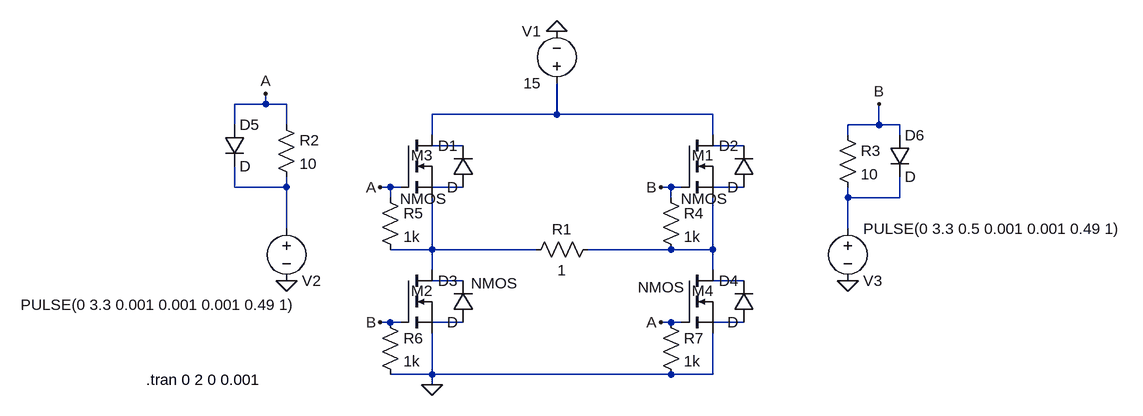
[diagram p0: schematic driver.asc]
driver.asc, the LTspice schematic file:
Version 4
SHEET 1 1168 680
WIRE -176 32 -176 16
WIRE -176 32 -224 32
WIRE -144 32 -176 32
WIRE 272 48 272 0
WIRE 272 48 80 48
WIRE 512 48 272 48
WIRE -224 64 -224 32
WIRE -144 64 -144 32
WIRE 768 64 768 32
WIRE 768 64 720 64
WIRE 800 64 768 64
WIRE 80 80 80 48
WIRE 512 80 512 48
WIRE 720 80 720 64
WIRE 800 80 800 64
WIRE 128 96 80 96
WIRE 560 96 512 96
WIRE -224 160 -224 128
WIRE -144 160 -144 144
WIRE -144 160 -224 160
WIRE 16 160 0 160
WIRE 32 160 16 160
WIRE 128 160 80 160
WIRE 448 160 432 160
WIRE 464 160 448 160
WIRE 560 160 512 160
WIRE 16 176 16 160
WIRE 448 176 448 160
WIRE 720 176 720 160
WIRE 800 176 800 144
WIRE 800 176 720 176
WIRE -144 224 -144 160
WIRE 720 224 720 176
WIRE 80 256 80 176
WIRE 80 256 16 256
WIRE 240 256 80 256
WIRE 448 256 320 256
WIRE 512 256 512 176
WIRE 512 256 448 256
WIRE 80 288 80 256
WIRE 512 288 512 256
WIRE 128 304 80 304
WIRE 560 304 512 304
WIRE 16 368 0 368
WIRE 32 368 16 368
WIRE 128 368 80 368
WIRE 448 368 432 368
WIRE 464 368 448 368
WIRE 560 368 512 368
WIRE 80 448 80 384
WIRE 80 448 16 448
WIRE 448 448 80 448
WIRE 512 448 512 384
WIRE 512 448 448 448
WIRE 80 464 80 448
FLAG 272 -80 0
FLAG 720 304 0
FLAG -144 304 0
FLAG 80 464 0
FLAG 432 160 B
FLAG 0 160 A
FLAG 432 368 A
FLAG 0 368 B
FLAG -176 16 A
FLAG 768 32 B
SYMBOL voltage 272 16 R180
WINDOW 0 24 96 Left 2
WINDOW 3 24 16 Left 2
WINDOW 123 0 0 Left 0
WINDOW 39 0 0 Left 0
SYMATTR InstName V1
SYMATTR Value 15
SYMBOL voltage -144 208 R0
WINDOW 0 24 96 Left 2
WINDOW 3 -409 133 Left 2
WINDOW 123 0 0 Left 0
WINDOW 39 0 0 Left 0
SYMATTR InstName V2
SYMATTR Value PULSE(0 3.3 0.001 0.001 0.001 0.49 1)
SYMBOL voltage 720 208 R0
WINDOW 0 24 96 Left 2
WINDOW 3 24 16 Left 2
WINDOW 123 0 0 Left 0
WINDOW 39 0 0 Left 0
SYMATTR InstName V3
SYMATTR Value PULSE(0 3.3 0.5 0.001 0.001 0.49 1)
SYMBOL diode 144 160 R180
WINDOW 0 24 64 Left 2
WINDOW 3 24 0 Left 2
SYMATTR InstName D1
SYMBOL nmos 32 80 R0
WINDOW 0 16 31 Left 2
WINDOW 3 -1 98 Left 2
SYMATTR InstName M3
SYMBOL diode 576 160 R180
WINDOW 0 24 64 Left 2
WINDOW 3 24 0 Left 2
SYMATTR InstName D2
SYMBOL nmos 464 80 R0
WINDOW 0 16 31 Left 2
WINDOW 3 -1 98 Left 2
SYMATTR InstName M1
SYMBOL diode 144 368 R180
WINDOW 0 24 64 Left 2
WINDOW 3 24 0 Left 2
SYMATTR InstName D3
SYMBOL nmos 32 288 R0
WINDOW 0 16 31 Left 2
WINDOW 3 108 20 Left 2
SYMATTR InstName M2
SYMBOL diode 576 368 R180
WINDOW 0 24 64 Left 2
WINDOW 3 24 0 Left 2
SYMATTR InstName D4
SYMBOL nmos 464 288 R0
WINDOW 0 16 31 Left 2
WINDOW 3 -67 26 Left 2
SYMATTR InstName M4
SYMBOL res 336 240 R90
WINDOW 0 0 56 VBottom 2
WINDOW 3 32 56 VTop 2
SYMATTR InstName R1
SYMATTR Value 1
SYMBOL res -160 48 R0
SYMATTR InstName R2
SYMATTR Value 10
SYMBOL diode -240 64 R0
SYMATTR InstName D5
SYMBOL res 704 64 R0
SYMATTR InstName R3
SYMATTR Value 10
SYMBOL diode 784 80 R0
SYMATTR InstName D6
SYMBOL res 432 160 R0
SYMATTR InstName R4
SYMATTR Value 1k
SYMBOL res 0 160 R0
SYMATTR InstName R5
SYMATTR Value 1k
SYMBOL res 0 352 R0
SYMATTR InstName R6
SYMATTR Value 1k
SYMBOL res 432 352 R0
SYMATTR InstName R7
SYMATTR Value 1k
TEXT -360 456 Left 2 !.tran 0 2 0 0.001

The netlist it stands for:
* driver.asc
V1 N001 0 15
V2 N004 0 PULSE(0 3.3 0.001 0.001 0.001 0.49 1)
V3 N007 0 PULSE(0 3.3 0.5 0.001 0.001 0.49 1)
D1 N005 N002 D
M3 N001 A N008 N008 NMOS
D2 N006 N003 D
M1 N001 B N009 N009 NMOS
D3 N012 N010 D
M2 N008 B 0 0 NMOS
D4 N013 N011 D
M4 N009 A 0 0 NMOS
R1 N009 N008 1
R2 A N004 10
D5 A N004 D
R3 B N007 10
D6 B N007 D
R4 B N009 1k
R5 A N008 1k
R6 B 0 1k
R7 A 0 1k
.model D D
.lib standard.dio
.model NMOS NMOS
.model PMOS PMOS
.lib standard.mos
.tran 0 2 0 0.001
.backanno
.end